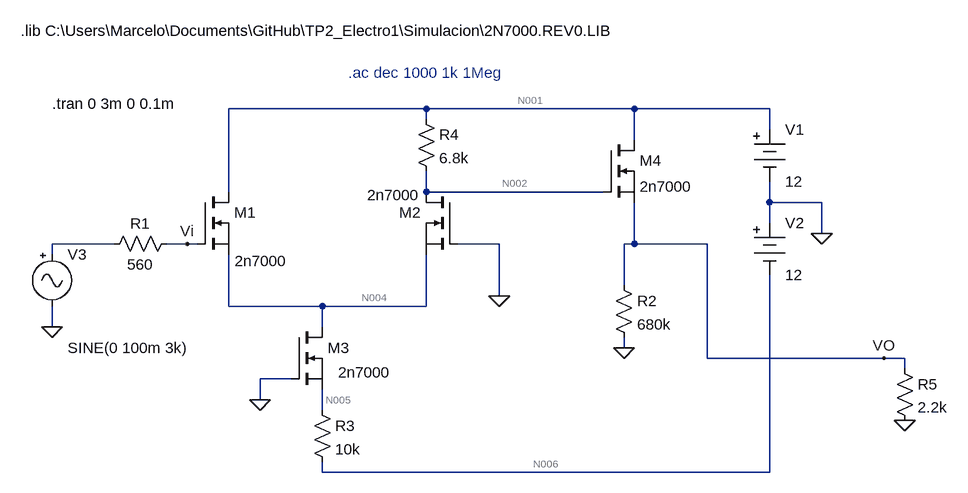
[diagram p0: schematic Amplif.asc]
Amplif.asc, the LTspice schematic file:
Version 4
SHEET 1 1592 680
WIRE 512 -144 208 -144
WIRE 832 -144 512 -144
WIRE 1040 -144 832 -144
WIRE 512 -128 512 -144
WIRE 1040 -112 1040 -144
WIRE 832 -96 832 -144
WIRE 208 -16 208 -144
WIRE 512 -16 512 -48
WIRE 784 -16 512 -16
WIRE 1040 0 1040 -32
WIRE 1120 0 1040 0
WIRE 1040 32 1040 0
WIRE 1120 48 1120 0
WIRE 32 64 -64 64
WIRE 144 64 112 64
WIRE 160 64 144 64
WIRE 624 64 560 64
WIRE 832 64 832 0
WIRE 832 64 816 64
WIRE 944 64 832 64
WIRE -64 80 -64 64
WIRE 816 128 816 64
WIRE 624 144 624 64
WIRE 208 160 208 80
WIRE 352 160 208 160
WIRE 512 160 512 80
WIRE 512 160 352 160
WIRE -64 192 -64 160
WIRE 352 192 352 160
WIRE 816 224 816 208
WIRE 944 240 944 64
WIRE 1216 240 944 240
WIRE 1248 240 1216 240
WIRE 1248 256 1248 240
WIRE 304 272 256 272
WIRE 256 304 256 272
WIRE 352 320 352 288
WIRE 352 416 352 400
WIRE 1040 416 1040 112
WIRE 1040 416 352 416
FLAG 624 144 0
FLAG 1120 48 0
FLAG 256 304 0
FLAG -64 192 0
FLAG 816 224 0
FLAG 1216 240 VO
FLAG 1248 336 0
FLAG 144 64 Vi
SYMBOL nmos 160 -16 R0
WINDOW 3 57 106 Left 2
SYMATTR Value 2n7000
SYMATTR InstName M1
SYMATTR Prefix X
SYMBOL nmos 560 -16 M0
WINDOW 3 58 5 Left 2
SYMATTR Value 2n7000
SYMATTR InstName M2
SYMATTR Prefix X
SYMBOL nmos 304 192 R0
WINDOW 3 72 70 Left 2
SYMATTR Value 2n7000
SYMATTR InstName M3
SYMATTR Prefix X
SYMBOL res 496 -144 R0
SYMATTR InstName R4
SYMATTR Value 6.8k
SYMBOL Misc\\battery 1040 -128 R0
WINDOW 123 0 0 Left 2
WINDOW 39 0 0 Left 2
SYMATTR InstName V1
SYMATTR Value 12
SYMBOL nmos 784 -96 R0
SYMATTR InstName M4
SYMATTR Value 2n7000
SYMATTR Prefix X
SYMBOL res 336 304 R0
SYMATTR InstName R3
SYMATTR Value 10k
SYMBOL Misc\\battery 1040 16 R0
WINDOW 123 0 0 Left 2
WINDOW 39 0 0 Left 2
SYMATTR InstName V2
SYMATTR Value 12
SYMBOL res 800 112 R0
SYMATTR InstName R2
SYMATTR Value 680k
SYMBOL res 128 48 R90
WINDOW 0 0 56 VBottom 2
WINDOW 3 32 56 VTop 2
SYMATTR InstName R1
SYMATTR Value 560
SYMBOL res 1232 240 R0
SYMATTR InstName R5
SYMATTR Value 2.2k
SYMBOL Misc\\signal -64 64 R0
WINDOW 3 24 160 Left 2
WINDOW 123 24 132 Left 2
WINDOW 39 0 0 Left 2
SYMATTR InstName V3
SYMATTR Value SINE(0 100m 3k)
TEXT -112 -264 Left 2 !.lib C:\\Users\\Marcelo\\Documents\\GitHub\\TP2_Electro1\\Simulacion\\2N7000.REV0.LIB
TEXT -64 -152 Left 2 !.tran 0 3m 0 0.1m
TEXT 392 -200 Left 2 ;.ac dec 1000 1k 1Meg

The netlist it stands for:
* Amplif.asc
XM1 N001 Vi N004 2n7000  ; pins D G S
XM2 N002 0 N004 2n7000  ; pins D G S
XM3 N004 0 N005 2n7000  ; pins D G S
R4 N001 N002 6.8k
V1 N001 0 12
XM4 N001 N002 VO 2n7000  ; pins D G S
R3 N005 N006 10k
V2 0 N006 12
R2 VO 0 680k
R1 Vi N003 560
R5 VO 0 2.2k
V3 N003 0 SINE(0 100m 3k)
.lib C:\Users\Marcelo\Documents\GitHub\TP2_Electro1\Simulacion\2N7000.REV0.LIB
.tran 0 3m 0 0.1m
* .ac dec 1000 1k 1Meg
.backanno
.end

* Results of the author's LTspice run, read from the files saved beside the schematic
* Operating Point, zero values left out:
*   V(n004) = -2.338 V
*   V(n001) = 12 V
*   V(n002) = 8.74 V
*   V(n005) = -2.413 V
*   V(vo) = 6.254 V
*   V(n006) = -12 V
*   I(R5) = 2.843 mA
*   I(R1) = 12 pA
*   I(R2) = 9.197 µA
*   I(R3) = 958.7 µA
*   I(R4) = 479.3 µA
*   I(V3) = 12 pA
*   I(V2) = -958.7 µA
*   I(V1) = -3.811 mA
*   Ix(m1:1) = 479.3 µA
*   Ix(m1:2) = -12 pA
*   Ix(m1:3) = -479.3 µA
*   Ix(m2:1) = 479.3 µA
*   Ix(m2:2) = -8.74 pA
*   Ix(m2:3) = -479.3 µA
*   Ix(m3:1) = 958.7 µA
*   Ix(m3:3) = -958.7 µA
*   Ix(m4:1) = 2.852 mA
*   Ix(m4:2) = -3.26 pA
*   Ix(m4:3) = -2.852 mA
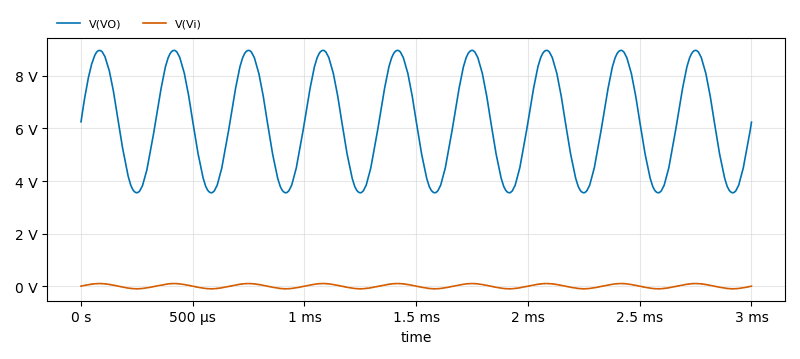
[diagram p1: Transient Analysis of Amplif.asc, plotted from the saved traces]
* Transient Analysis, 1 run:
*   V(VO): min 3.554 V, max 8.973 V, average 6.269 V, rms 6.57 V, last 6.242 V
*   V(Vi): min -99.76 mV, max 99.72 mV, average 211.3 µV, rms 70.24 mV, last -14.71 µV